# Altium schematic sheet 06_MCU.SchDoc
size A4; Author: Gabriel; Organization: Altium Limited; Address1: L3, 12a Rodborough Rd; Address2: Frenchs Forest; Address3: NSW; Address4: Australia 2086; SheetNumber: 1; SheetTotal: 1
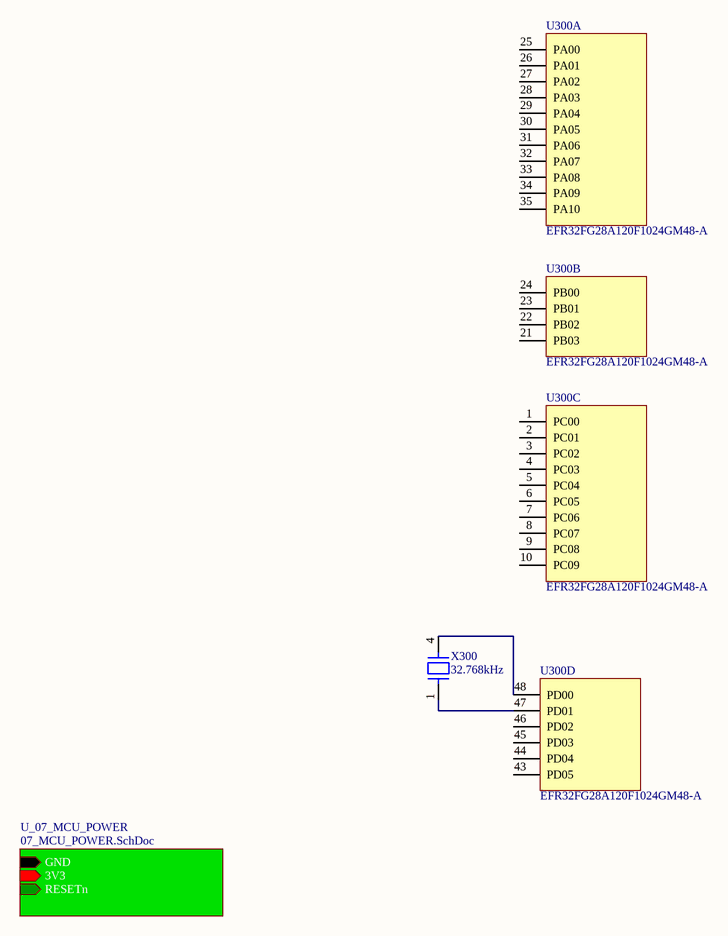
[diagram p0: 06_MCU.SchDoc]

## Parts
U300  MANUFACTURER REFERENCE: EFR32FG28A120F1024GM48-A  [QFN48 0606]  (hidden comment: MCU_1MB_256kB_EFR32FG28A120F1024GM48-A)  (parts A,B,C,D of 6)
X300  FREQUENCY: 32.768kHz  [QUARTZ_4-SOJ_5.5mm]  (hidden comment: QUARTZ_32.768kHz_20ppm_830016178)

## Sub-sheets
U_07_MCU_POWER = 07_MCU_POWER.SchDoc: GND (in), 3V3 (in), RESETn (in)

## Nets
NetU300_47: U300.47(PD01) X300.1
NetU300_48: U300.48(PD00) X300.4

Not connected (* = marked no-connect by the designer): U300 1(PC00) 2(PC01) 3(PC02) 4(PC03) 5(PC04) 6(PC05) 7(PC06) 8(PC07) 9(PC08) 10(PC09) 21(PB03) 22(PB02) 23(PB01) 24(PB00) 25(PA00) 26(PA01) 27(PA02) 28(PA03) 29(PA04) 30(PA05) 31(PA06) 32(PA07) 33(PA08) 34(PA09) 35(PA10) 43(PD05) 44(PD04) 45(PD03) 46(PD02)

## Notes on the sheet
- TITLE:
- CREATED BY
- MODIFIED DATE
- PAGE
- /

## Library data of the parts
U300 = MCU_1MB_256kB_EFR32FG28A120F1024GM48-A: MCU 1MB 256kB EFR32FG28A120F1024GM48-A; MANUFACTURER: SILICON LABS; PACKAGING: QFN48 0606; FLASH SIZE: 1 MB; RAM SIZE: 256 KB; PIN COUNT: 48
X300 = QUARTZ_32.768kHz_20ppm_830016178: QUARTZ 32.768kHz 20ppm 830016178; MANUFACTURER: WURTH; MANUFACTURER REFERENCE: 830016178; MOUNTING: SMD; PACKAGING: 4-SOJ; TOLERANCE: 20 ppm